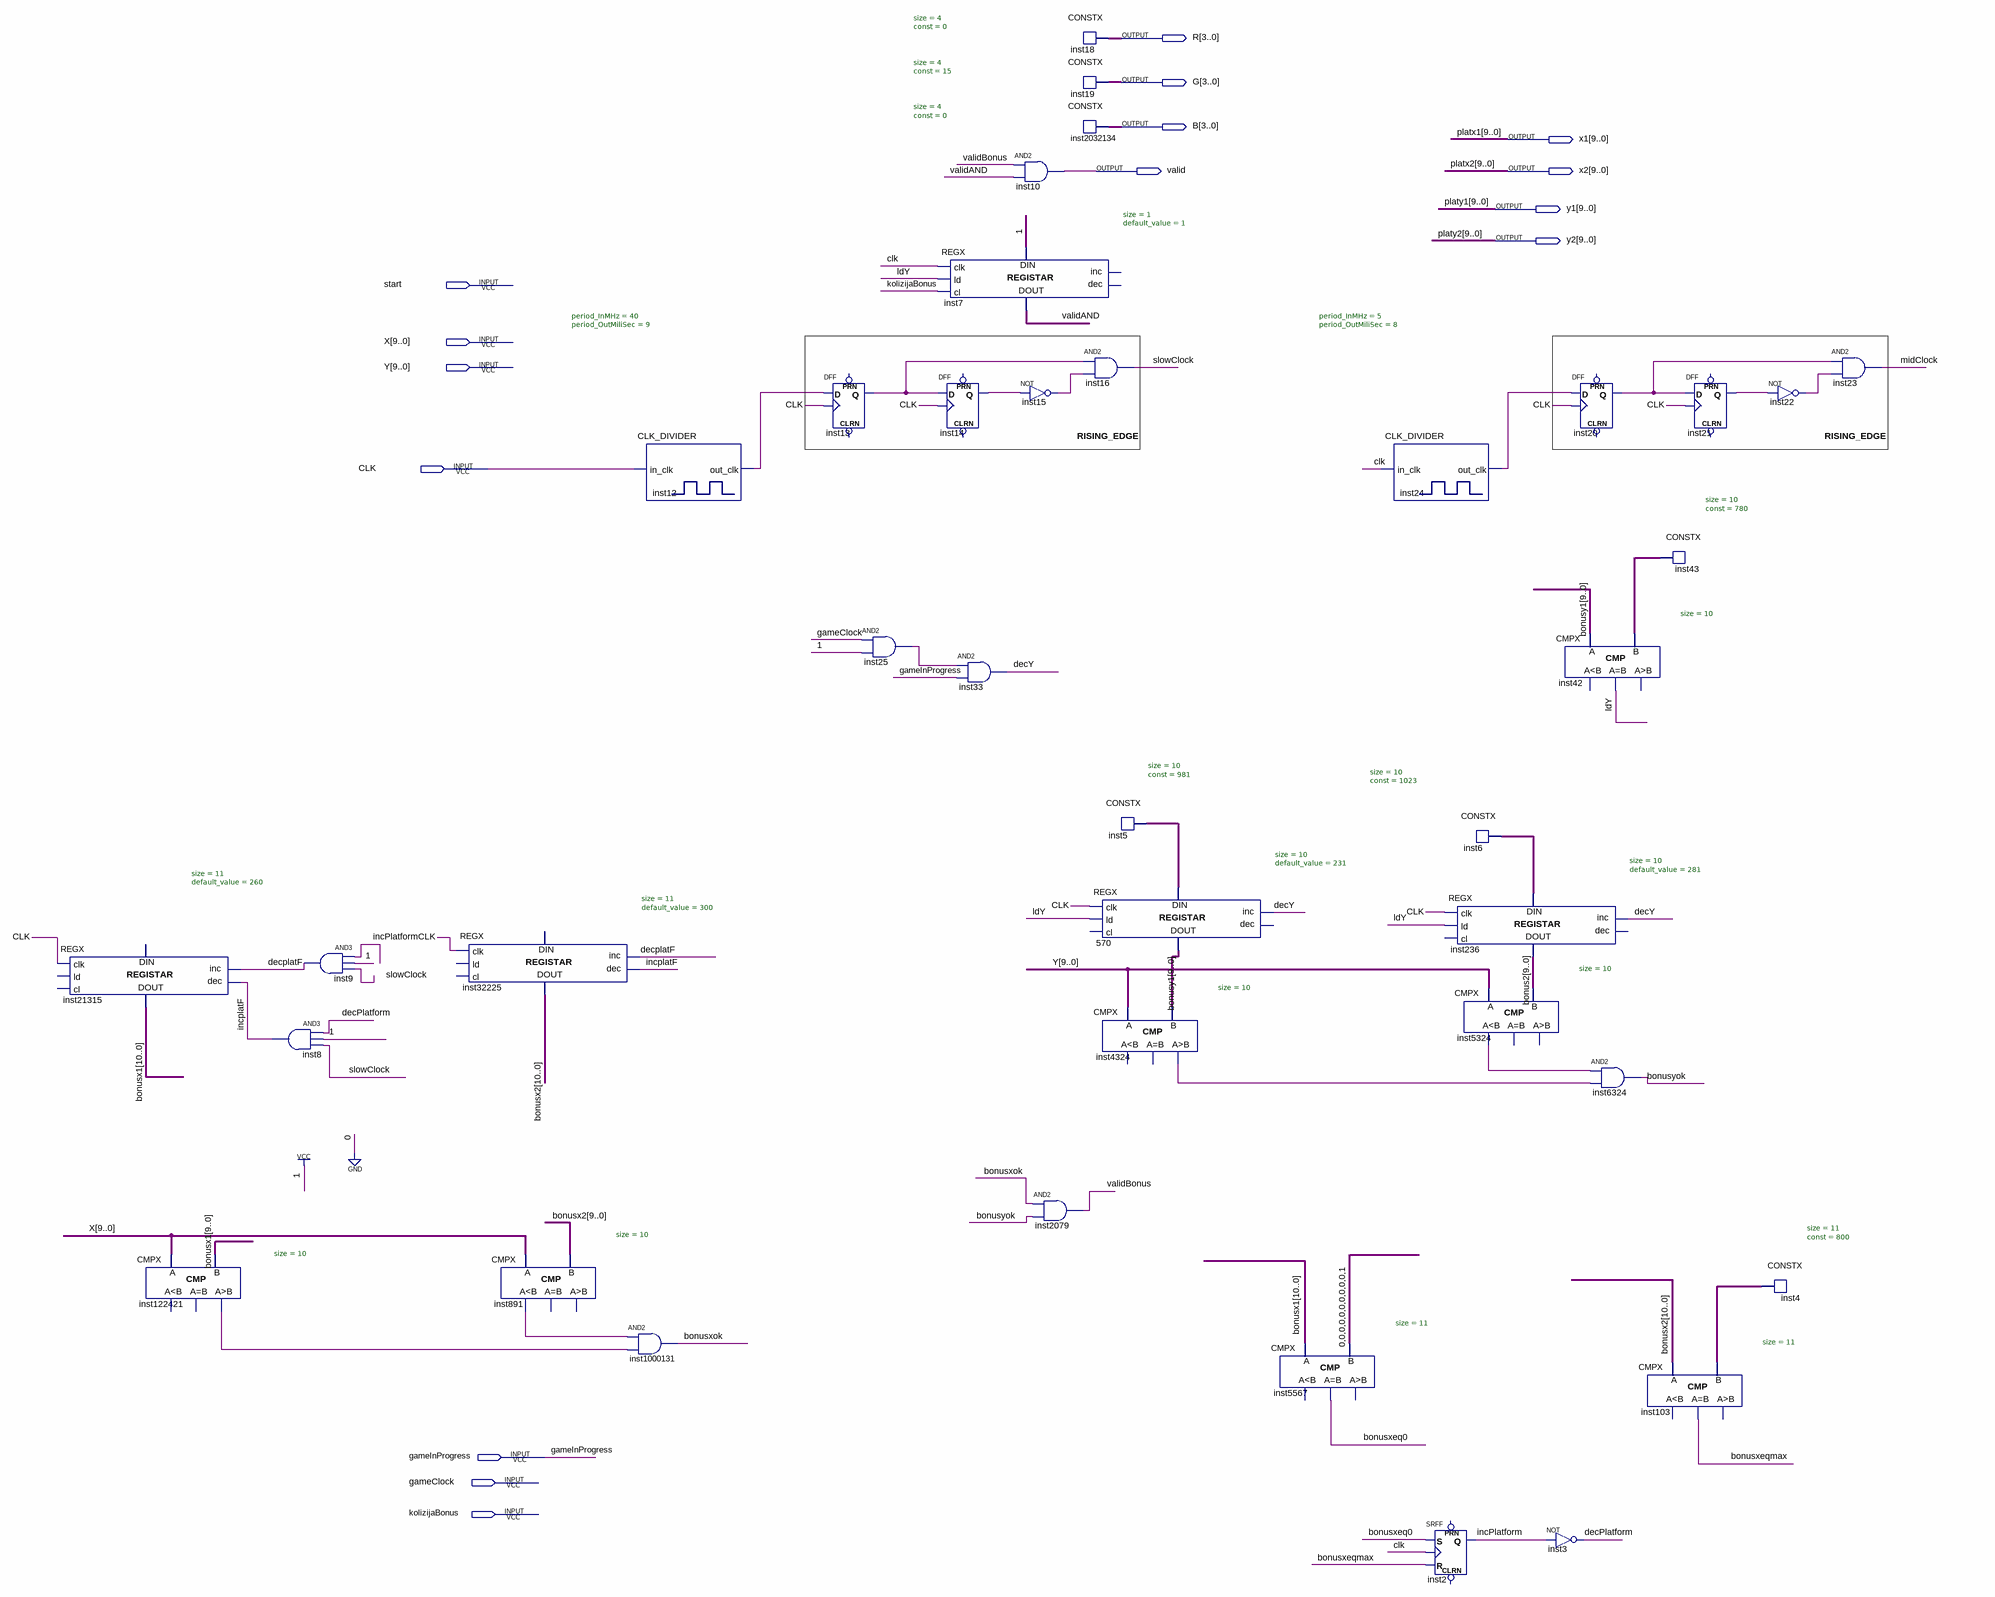
[diagram p0: schematic sheet]
// Quartus schematic LayerBonus.bdf as structural Verilog: 39 symbols, 15 pins
module LayerBonus (
  input  start,
  input  [9:0] X,
  input  [9:0] Y,
  input  CLK,
  input  gameInProgress,
  input  gameClock,
  input  kolizijaBonus,
  output [3:0] R,
  output [3:0] G,
  output [3:0] B,
  output [9:0] x1,
  output valid,
  output [9:0] x2,
  output [9:0] y1,
  output [9:0] y2
);

  wire bonusxeq0, bonusxeqmax, bonusxok, bonusyok, decplatF, decPlatform, decY, incplatF, incPlatform,
       inst12_out_clk, inst13_q, inst14_q, inst15_out, inst20_q, inst21_q, inst22_out, inst24_out_clk,
       inst25_out, inst891_ls, inst4324_gr, inst5324_ls, inst122421_gr, ldY, midClock, slowClock, validAND,
       validBonus;
  wire [9:0] bonus2, bonusy1, inst5_data, inst6_data, inst43_data;
  wire [10:0] bonusx1, bonusx2, inst4_data;

  REGX #(.size(11), .default_value(260)) inst21315 (
    .clk(CLK), .inc(decplatF), .dec(incplatF), .data_out(bonusx1));  // open: ld, cl, data_in
  CMPX #(.size(10)) inst122421 (.A(X), .B(bonusx1[9:0]), .gr(inst122421_gr));  // open: ls, eq
  and inst8 (incplatF, decPlatform, 1'b1, slowClock);
  and inst9 (decplatF, incPlatform, 1'b1, slowClock);
  REGX #(.size(11), .default_value(300)) inst32225 (
    .clk(CLK), .inc(decplatF), .dec(incplatF), .data_out(bonusx2));  // open: ld, cl, data_in
  CMPX #(.size(10)) inst891 (.A(X), .B(bonusx2[9:0]), .ls(inst891_ls));  // open: eq, gr
  CLK_DIVIDER #(.period_InMHz(40), .period_OutMiliSec(9)) inst12 (.in_clk(CLK), .out_clk(inst12_out_clk));
  and inst1000131 (bonusxok, inst891_ls, inst122421_gr);
  DFF inst13 (.CLK(CLK), .D(inst12_out_clk), .Q(inst13_q));  // open: CLRN, PRN
  and inst25 (inst25_out, gameClock, 1'b1);
  REGX #(.size(1), .default_value(1)) inst7 (
    .clk(CLK), .ld(ldY), .cl(kolizijaBonus), .data_in(1'b1), .data_out(validAND));  // open: inc, dec
  DFF inst14 (.CLK(CLK), .D(inst13_q), .Q(inst14_q));  // open: CLRN, PRN
  and inst33 (decY, inst25_out, gameInProgress);
  and inst10 (valid, validBonus, validAND);
  not inst15 (inst15_out, inst14_q);
  and inst2079 (validBonus, bonusxok, bonusyok);
  CONSTX #(.size(4), .\const (0)) inst18 (.data(R));
  CONSTX #(.size(4), .\const (15)) inst19 (.data(G));
  CONSTX #(.size(4), .\const (0)) inst2032134 (.data(B));
  and inst16 (slowClock, inst13_q, inst15_out);
  CONSTX #(.size(10), .\const (981)) inst5 (.data(inst5_data));
  REGX #(.size(10), .default_value(231)) u_570 (
    .clk(CLK), .ld(ldY), .inc(decY), .data_in(inst5_data), .data_out(bonusy1));  // open: cl, dec
  CMPX #(.size(10)) inst4324 (.A(Y), .B(bonusy1), .gr(inst4324_gr));  // open: ls, eq
  CMPX #(.size(11)) inst5567 (.A(bonusx1), .B(11'b00000000001), .eq(bonusxeq0));  // open: ls, gr
  CLK_DIVIDER #(.period_InMHz(5), .period_OutMiliSec(8)) inst24 (.in_clk(CLK), .out_clk(inst24_out_clk));
  CONSTX #(.size(10), .\const (1023)) inst6 (.data(inst6_data));
  REGX #(.size(10), .default_value(281)) inst236 (
    .clk(CLK), .ld(ldY), .inc(decY), .data_in(inst6_data), .data_out(bonus2));  // open: cl, dec
  CMPX #(.size(10)) inst5324 (.A(Y), .B(bonus2), .ls(inst5324_ls));  // open: eq, gr
  SRFF inst2 (.S(bonusxeq0), .R(bonusxeqmax), .CLK(CLK), .Q(incPlatform));  // open: PRN, CLRN
  CMPX #(.size(10)) inst42 (.A(bonusy1), .B(inst43_data), .eq(ldY));  // open: ls, gr
  not inst3 (decPlatform, incPlatform);
  DFF inst20 (.CLK(CLK), .D(inst24_out_clk), .Q(inst20_q));  // open: CLRN, PRN
  and inst6324 (bonusyok, inst5324_ls, inst4324_gr);
  CONSTX #(.size(10), .\const (780)) inst43 (.data(inst43_data));
  CMPX #(.size(11)) inst103 (.A(bonusx2), .B(inst4_data), .eq(bonusxeqmax));  // open: ls, gr
  DFF inst21 (.CLK(CLK), .D(inst20_q), .Q(inst21_q));  // open: CLRN, PRN
  CONSTX #(.size(11), .\const (800)) inst4 (.data(inst4_data));
  not inst22 (inst22_out, inst21_q);
  and inst23 (midClock, inst20_q, inst22_out);

  // Other names for the same wires on the sheet: platx1[9:0] = x1; platx2[9:0] = x2; platy1[9:0] = y1;
  //   platy2[9:0] = y2

  // Notes on the sheet:
  //   RISING_EDGE
  //   RISING_EDGE
endmodule
